# Altium schematic sheet IBOARD.SchDoc
size A3; SheetNumber: 7; SheetTotal: 8
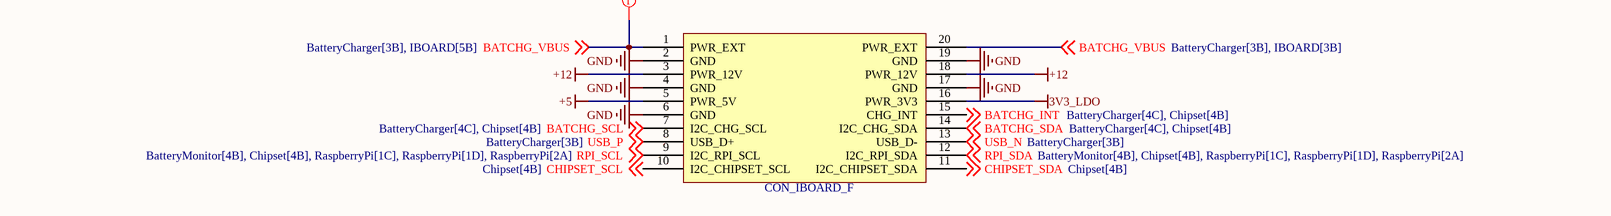
[diagram p0: IBOARD.SchDoc]

## Parts
CON_IBOARD_F  I-BOARD  [HC-PM254-8.5H-2x10PS]  (value not drawn)

## Nets
3V3_LDO: CON_IBOARD_F.16(PWR_3V3)
+5: CON_IBOARD_F.5(PWR_5V)
+12: CON_IBOARD_F.3(PWR_12V) CON_IBOARD_F.18(PWR_12V)
GND: CON_IBOARD_F.2(GND) CON_IBOARD_F.4(GND) CON_IBOARD_F.6(GND) CON_IBOARD_F.17(GND) CON_IBOARD_F.19(GND)
BATCHG_INT: CON_IBOARD_F.15(CHG_INT) ; off-sheet BATCHG_INT
BATCHG_SCL: CON_IBOARD_F.7(I2C_CHG_SCL) ; off-sheet BATCHG_SCL
BATCHG_SDA: CON_IBOARD_F.14(I2C_CHG_SDA) ; off-sheet BATCHG_SDA
BATCHG_VBUS: CON_IBOARD_F.1(PWR_EXT) CON_IBOARD_F.20(PWR_EXT) ; off-sheet BATCHG_VBUS
CHIPSET_SCL: CON_IBOARD_F.10(I2C_CHIPSET_SCL) ; off-sheet CHIPSET_SCL
CHIPSET_SDA: CON_IBOARD_F.11(I2C_CHIPSET_SDA) ; off-sheet CHIPSET_SDA
RPI_SCL: CON_IBOARD_F.9(I2C_RPI_SCL) ; off-sheet RPI_SCL
RPI_SDA: CON_IBOARD_F.12(I2C_RPI_SDA) ; off-sheet RPI_SDA
USB_N: CON_IBOARD_F.13(USB_D-) ; off-sheet USB_N
USB_P: CON_IBOARD_F.8(USB_D+) ; off-sheet USB_P

## Layout directives
net class HI_PWR: BATCHG_VBUS